# Altium schematic sheet Power.SchDoc
size A4; SheetNumber: 7; SheetTotal: 7
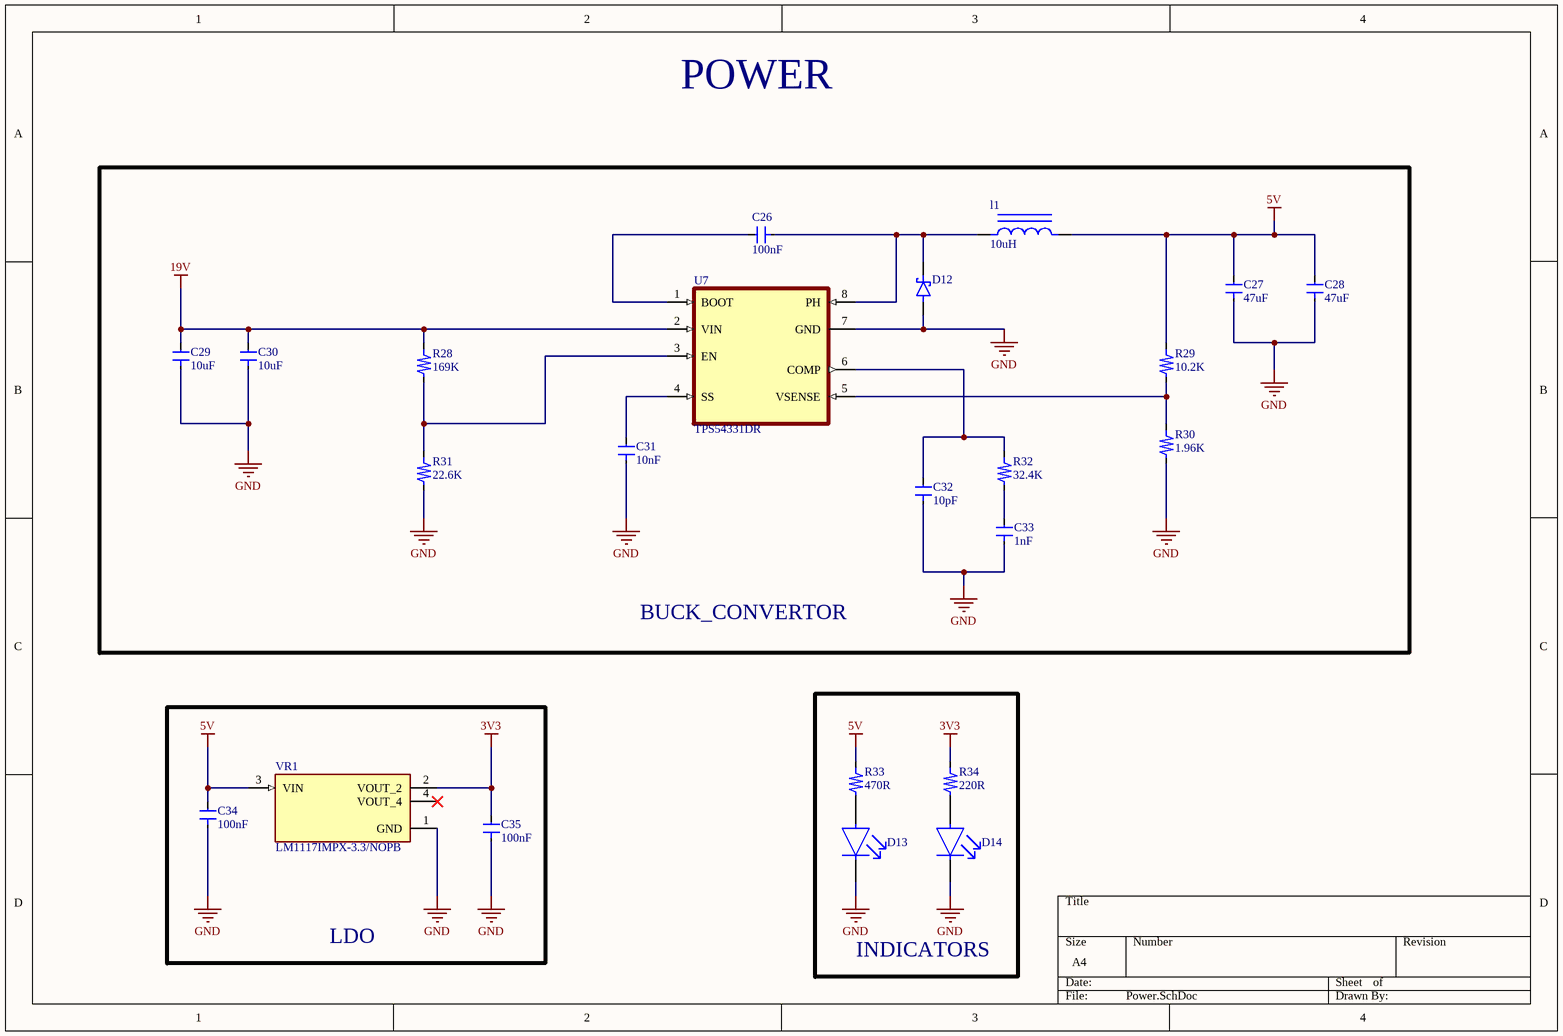
[diagram p0: Power.SchDoc]

## Parts
C26  100nF  [CAP 0603]
C27  47uF  [CAP 0603]
C28  47uF  [CAP 0603]
C29  10uF  [CAP 0805]
C30  10uF  [CAP 0805]
C31  10nF  [CAP 0603]
C32  10pF  [CAP 0603]
C33  1nF  [CAP 0603]
C34  100nF  [CAP 0603]
C35  100nF  [CAP 0603]
D12  B340A-E3/61T  [DIOM5126X229N]  (value not drawn)
D13  LED  [LED]  (value not drawn)
D14  LED  [LED]  (value not drawn)
l1  10uH  [INDUCTOR]
R28  169K  [RES 0603]
R29  10.2K  [RES 0603]
R30  1.96K  [RES 0603]
R31  22.6K  [RES 0603]
R32  32.4K  [RES 0603]
R33  470R  [RES 0603]
R34  220R  [RES 0603]
U7  TPS54331DR  [SOIC127P599X175-8N]
VR1  LM1117IMPX-3.3/NOPB  [VREG_LM1117IMPX-3.3/NOPB]

## Blocks framed on the sheet
BUCK_CONVERTOR: C26-C33 D12 l1 R28-R32 U7
LDO: C34 C35 VR1
INDICATORS: D13 D14 R33 R34

## Nets
3V3: C35.2 R34.1 VR1.2(VOUT_2)
5V: C27.2 C28.2 C34.2 l1.2 R29.1 R33.1 VR1.3(VIN)
19V: C29.2 C30.2 R28.1 U7.2(VIN)
GND: C27.1 C28.1 C29.1 C30.1 C31.1 C32.1 C33.1 C34.1 C35.1 D12.A D13.1(C) D14.1(C) R30.2 R31.2 U7.7(GND) VR1.1(GND)
NetC26_1: C26.1 D12.C l1.1 U7.8(PH)
NetC26_2: C26.2 U7.1(BOOT)
NetC31_2: C31.2 U7.4(SS)
NetC32_2: C32.2 R32.1 U7.6(COMP)
NetC33_2: C33.2 R32.2
NetD13_2: D13.2(A) R33.2
NetD14_2: D14.2(A) R34.2
NetR28_2: R28.2 R31.1 U7.3(EN)
NetR29_2: R29.2 R30.1 U7.5(VSENSE)

Not connected (* = marked no-connect by the designer): VR1 4(VOUT_4)*

## Notes on the sheet
- POWER

## Library data of the parts
C26 C34 C35 = Capasitor: Part Number: CC0603JRX7R9BB104; Manufacture: YAGEO; Footprint size: 0603; ComponentLink1Description: New link; ComponentLink1URL: *; Supplier: LCSC; Supplier Part Number: C91183; Link: https://www.lcsc.com/product-detail/C91183.html
C27 C28 = Capasitor: Part Number: GRM188R60J476ME15D; Manufacture: muRata; Footprint size: 0603; ComponentLink1Description: New link; ComponentLink1URL: *; Supplier: LCSC; Supplier Part Number: C140782; Link: https://www.lcsc.com/product-detail/C140782.html?spm=wm.fly.bg.0.xh&lcsc_vid=EwNbUgICTlRcBlxXEQRYAgYAFVkLVwZURVRZBVcDFVcxVlNRQVZbUlVUQ1BaVDsOAxUeFF5JWBYZEEoKFBINSQcJGk4NBhADEA4cHktXRlVcSQwSGg0%3D
C29 C30 = Capasitor: Part Number: GRM21BR61H106KE43L; Manufacture: muRata; Footprint size: 0805; ComponentLink1Description: New link; ComponentLink1URL: *; Supplier: LCSC; Supplier Part Number: C440198; Link: https://www.lcsc.com/product-detail/C440198.html?spm=wm.fly.bg.0.xh___wm.sy.dhl.mly.12-0-4&lcsc_vid=EwNbUgICTlRcBlxXEQRYAgYAFVkLVwZURVRZBVcDFVcxVlNRQVZbVl1eT1ddXzsOAxUeFF5JWBYZEEoBGA4JCwFIFA4DSA%3D%3D
C31 = Capasitor: Part Number: CC0603JRX7R9BB103; Manufacture: YAGEO; Footprint size: 0603; ComponentLink1Description: New link; ComponentLink1URL: *; Supplier: LCSC; Supplier Part Number: C115056; Link: https://www.lcsc.com/product-detail/C115056.html?spm=wm.fly.bg.0.xh___wm.sxq.ssx.dcs.1&lcsc_vid=EwNbUgICTlRcBlxXEQRYAgYAFVkLVwZURVRZBVcDFVcxVlNRQVZbVV1VQ1VZVTsOAxUeFF5JWBYZEEoKFBINSQcJGk4NBhADEA4cHktXRlVcSQwSGg0%3D
C32 = Capasitor: Part Number: GRM1885C1H100FA01D; Manufacture: muRata; Footprint size: 0603; ComponentLink1Description: New link; ComponentLink1URL: *; Supplier: LCSC; Supplier Part Number: C162202; Link: https://www.lcsc.com/product-detail/C162202.html?spm=wm.fly.bg.0.xh&lcsc_vid=EwNbUgICTlRcBlxXEQRYAgYAFVkLVwZURVRZBVcDFVcxVlNRQVZbU11QRVlbVzsOAxUeFF5JWBYZEEoKFBINSQcJGk4NBhADEA4cHktXRlVcSQwSGg0%3D
C33 = Capasitor: Part Number: GRM1885C1H102FA01D; Manufacture: muRata; Footprint size: 0603; ComponentLink1Description: New link; ComponentLink1URL: *; Supplier: LCSC; Supplier Part Number: C913702; Link: https://www.lcsc.com/product-detail/C913702.html?spm=wm.fly.bg.0.xh&lcsc_vid=EwNbUgICTlRcBlxXEQRYAgYAFVkLVwZURVRZBVcDFVcxVlNRQVZbU1xWRlhcUDsOAxUeFF5JWBYZEEoKFBINSQcJGk4NBhADEA4cHktXRlVcSQwSGg0%3D
D12 = B340A-E3/61T: Diode Schottky 40 V 3A Surface Mount DO-214AC (SMA); Manufacture: VISHAY; Part Number: B340A-E3/61T; Footprint size: SMA(DO-214AC); Supplier: LCSC; Supplier Part Number: C15570; Link: https://www.lcsc.com/product-detail/C15570.html?s_z=n_q_B340A-E3%252F61T&spm=wm.ssy.bg.0.xh&lcsc_vid=RFYMBlMFQAQLUVJeFVJZXwVeRFYIAgBXEVkPUlxRRVUxVlNRQVZaVFVTRFJeXzsOAxUeFF5JWBYZEEoKFBINSQcJGk4%3D
D13 D14 = LED: Manufacture: XINGLIGHT; Part Number: XL-2012SURC; Footprint size: 0805; ComponentLink1Description: New link; ComponentLink1URL: *; Supplier: LCSC; Supplier Part Number: C965812; Link: https://www.lcsc.com/product-detail/C965812.html?s_z=n_XL-2012SURC
l1 = Iductor: Manufacture: YJYCOIN; Part Number: YPRH8D43-100M; Footprint size: SMD,8x8mm; ComponentLink1Description: New link; ComponentLink1URL: *; Supplier: LCSC; Supplier Part Number: C338825; Link: https://www.lcsc.com/product-detail/C338825.html?spm=wm.fly.bg.0.xh___wm.sy.top.tjl.8-42&lcsc_vid=EwNbUgICTlRcBlxXEQRYAgYAFVkLVwZURVRZBVcDFVcxVlNRQVZaUFVXRFFYXzsOAxUeFF5JWBYZEEoBGA4JCwFIFA4DSA%3D%3D
R28 = Resistor: Manufacture: Viking; Part Number: AR03FTC1693; Footprint size: 0603; ComponentLink1Description: New link; ComponentLink1URL: *; Supplier: LCSC; Supplier Part Number: C234308; Link: https://www.lcsc.com/product-detail/C234308.html?spm=wm.fly.bg.0.xh___wm.sy.top.tjl.8-58&lcsc_vid=EwNbUgICTlRcBlxXEQRYAgYAFVkLVwZURVRZBVcDFVcxVlNRQVZbVVZVQFVdUjsOAxUeFF5JWBYZEEoBGA4JCwFIFA4DSA%3D%3D
R29 = Resistor: Manufacture: FH; Part Number: RS-03K1022FT; Footprint size: 0603; ComponentLink1Description: New link; ComponentLink1URL: *; Supplier: LCSC; Supplier Part Number: C321670; Link: https://www.lcsc.com/product-detail/C321670.html?spm=wm.fly.bg.0.xh&lcsc_vid=EwNbUgICTlRcBlxXEQRYAgYAFVkLVwZURVRZBVcDFVcxVlNRQVZbVFNfTlZfUzsOAxUeFF5JWBYZEEoKFBINSQcJGk4NBhADEA4cHktXRlhXSQwSGg0%3D
R30 = Resistor: Manufacture: FOJAN; Part Number: FRC0603F1961TS; Footprint size: 0603; ComponentLink1Description: New link; ComponentLink1URL: *; Supplier: LCSC; Supplier Part Number: C2998107; Link: https://www.lcsc.com/product-detail/C2998107.html?spm=wm.fly.bg.1.xh&lcsc_vid=EwNbUgICTlRcBlxXEQRYAgYAFVkLVwZURVRZBVcDFVcxVlNRQVZbVF1eT1JZUjsOAxUeFF5JWBYZEEoKFBINSQcJGk4NBhADEA4cHktXRlhXSQwSGg0%3D
R31 = Resistor: Manufacture: FH; Part Number: RS-03K2262FT; Footprint size: 0603; ComponentLink1Description: New link; ComponentLink1URL: *; Supplier: LCSC; Supplier Part Number: C304721; Link: https://www.lcsc.com/product-detail/C304721.html?spm=wm.fly.bg.0.xh&lcsc_vid=EwNbUgICTlRcBlxXEQRYAgYAFVkLVwZURVRZBVcDFVcxVlNRQVZbVVFeRVlaVjsOAxUeFF5JWBYZEEoKFBINSQcJGk4NBhADEA4cHktXRlhXSQwSGg0%3D
R32 = Resistor: Manufacture: FH; Part Number: RS-03K3242FT; Footprint size: 0603; ComponentLink1Description: New link; ComponentLink1URL: *; Supplier: LCSC; Supplier Part Number: C304734; Link: https://www.lcsc.com/product-detail/C304734.html?spm=wm.fly.bg.2.xh&lcsc_vid=EwNbUgICTlRcBlxXEQRYAgYAFVkLVwZURVRZBVcDFVcxVlNRQVZbU1FfQlVZVjsOAxUeFF5JWBYZEEoKFBINSQcJGk4NBhADEA4cHktXRlhXSQwSGg0%3D
R33 = Resistor: Manufacture: VISHAY; Part Number: CRCW0603470RJNEA; Footprint size: 0603; ComponentLink1Description: New link; ComponentLink1URL: *; Supplier: LCSC; Supplier Part Number: C844367; Link: https://www.lcsc.com/product-detail/C844367.html?spm=wm.fly.bg.1.xh___wm.fly.tp.1.ml&lcsc_vid=RFYMBlMFQAQLUVJeFVJZXwVeRFYIAgBXEVkPUlxRRVUxVlNRQVdbX1ZUQVNZXzsOAxUeFF5JWBYZEEoBGA4JCwFIFA4DSA%3D%3D
R34 = Resistor: Manufacture: YAGEO; Part Number: RC0603JR-07220RL; Footprint size: 0603; ComponentLink1Description: New link; ComponentLink1URL: *; Supplier: LCSC; Supplier Part Number: C114683; Link: https://www.lcsc.com/product-detail/C114683.html
U7 = TPS54331DR: 3.5V to 28V Input, 3A, 570kHz Step-Down Converter with Eco-mode; Manufacture: TI; Part Number: TPS54331DR; Footprint size: SOIC-8; Supplier Part Number: C9865; Supplier: LCSC; Link: https://www.lcsc.com/product-detail/C9865.html?s_z=n_q_TPS54331DR&spm=wm.ssy.bg.0.xh&lcsc_vid=RFYMBlMFQAQLUVJeFVJZXwVeRFYIAgBXEVkPUlxRRVUxVlNRQFJZVVdfQlFbUzsOAxUeFF5JWBYZEEoKFBINSQcJGk4eFQsCAgIaSgADAwAHC0slRlJfVFdSWQkaCgg%3D
VR1 = LM1117IMPX-3.3/NOPB: 800-mA 15-V linear voltage regulator; Manufacture: TI; Part Number: LM1117IMPX-3.3/NOPB; Footprint size: SOT-223; Supplier: LCSC; Supplier Part Number: C23984; Link: https://www.lcsc.com/product-detail/C23984.html?s_z=n_q_LM1117IMPX-3.3%252FNOPB&spm=wm.fly.bg.0.xh&lcsc_vid=RFYMBlMFQAQLUVJeFVJZXwVeRFYIAgBXEVkPUlxRRVUxVlNRT1BZUlZeT1FeVzsOAxUeFF5JWBYZEEoKFBINSQcJGk4eFQsCAgIaSgADAwAHC0slRFleVl1eWQkaCgg%3D